# Altium schematic sheet MCUDEV_TFT_144.SchDoc
size A4
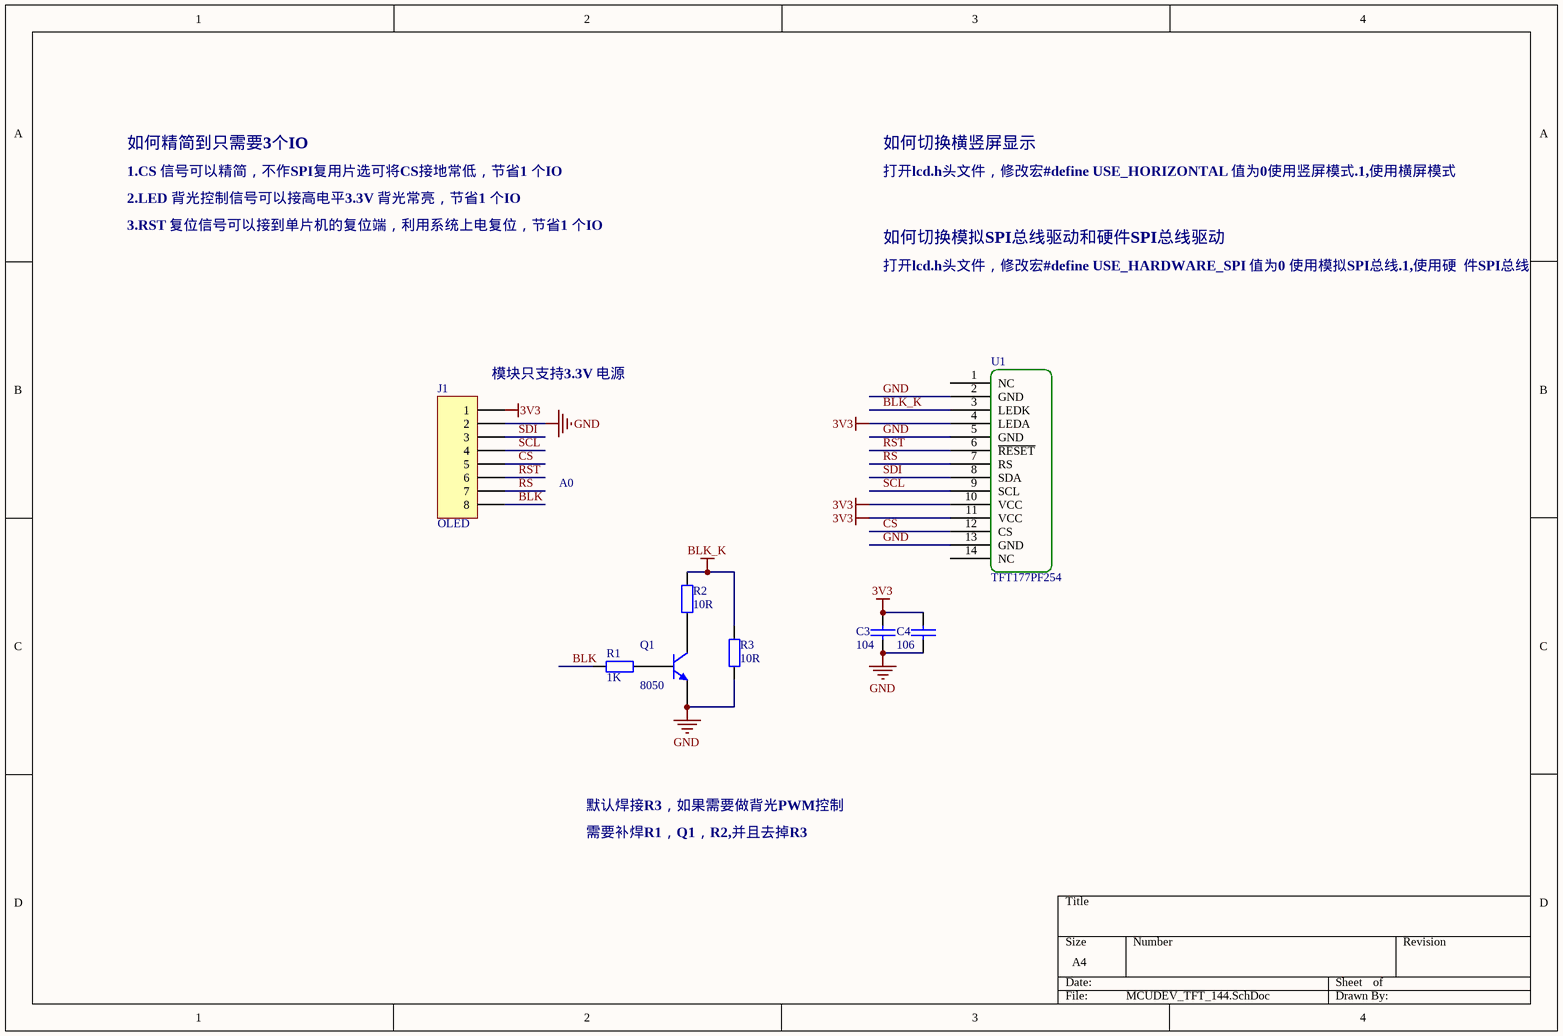
[diagram p0: MCUDEV_TFT_144.SchDoc]

## Parts
C3  104  [RC0603]
C4  106  [RC0805]
J1  OLED  [LCD_SPI8]
Q1  8050  [NPN]
R1  1K  [RC0603]
R2  10R  [RC0603]
R3  10R  [RC0603]
U1  TFT177PF254  [TFT177PF254]

## Nets
3V3: C3.1 C4.1 J1.1 U1.4(LEDA) U1.10(VCC) U1.11(VCC)
BLK_K: R2.2 R3.2 U1.3(LEDK)
GND: C3.2 C4.2 J1.2 Q1.3(E) R3.1 U1.2(GND) U1.5(GND) U1.13(GND)
BLK: J1.8 R1.2
CS: J1.5 U1.12(CS)
RS: J1.7 U1.7(RS)
RST: J1.6 U1.6(~{RESET})
SCL: J1.4 U1.9(SCL)
SDI: J1.3 U1.8(SDA)
NetQ1_1: Q1.1(B) R1.1
NetQ1_2: Q1.2(C) R2.1

Not connected (* = marked no-connect by the designer): U1 1(NC) 14(NC)

## Notes on the sheet
- 如何精简到只需要3个IO
- 1.CS 信号可以精简，不作SPI复用片选可将CS接地常低，节省1 个IO
- 如何切换横竖屏显示
- 打开lcd.h头文件，修改宏#define USE_HORIZONTAL 值为0使用竖屏模式.1,使用横屏模式
- 2.LED 背光控制信号可以接高电平3.3V 背光常亮，节省1 个IO
- 3.RST 复位信号可以接到单片机的复位端，利用系统上电复位，节省1 个IO
- 如何切换模拟SPI总线驱动和硬件SPI总线驱动
- 打开lcd.h头文件，修改宏#define USE_HARDWARE_SPI 值为0 使用模拟SPI总线.1,使用硬  件SPI总线
- (near J1) 模块只支持3.3V 电源
- A0
- 默认焊接R3，如果需要做背光PWM控制
- 需要补焊R1，Q1，R2,并且去掉R3

## Library data of the parts
C3 C4 = CAP: Capacitor
J1 = Header 8: Header, 8-Pin; LatestRevisionDate: 17-Jul-2002; LatestRevisionNote: Re-released for DXP Platform.; Publisher: Altium Limited
Q1 = 2N3904: NPN General Purpose Amplifier
R1-R3 = Res2: Resistor